# EAGLE design untitled (EAGLE 4.16)
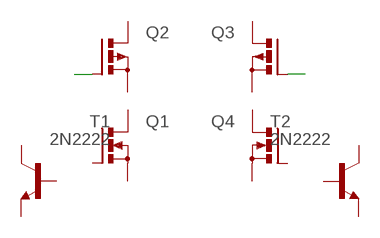
[diagram p0: schematic, sheet 1]

## Parts
Q1  PMOSFET_NTO220BV  [TO220BV]
Q2  PMOSFET_PTO220BV  [TO220BV]
Q3  PMOSFET_PTO220BV  [TO220BV]
Q4  PMOSFET_NTO220BV  [TO220BV]
T1  2N2222  [TO18]
T2  2N2222  [TO18]

## Nets
N$2: Q2.G
N$3: Q3.G
Unconnected: Q1.D Q1.G Q1.S Q2.D Q2.S Q3.D Q3.S Q4.D Q4.G Q4.S T1.1(E) T1.2(B) T1.3(C) T2.1(E) T2.2(B) T2.3(C)

## Library data of the parts
Q1 Q4 = transistor-power:PMOSFET_N: Power MOSFET N-Channel
Q2 Q3 = transistor-power:PMOSFET_P: Power MOSFET P-Channel
T1 T2 = transistor:2N2222: NPN TRANSISTOR

## Board
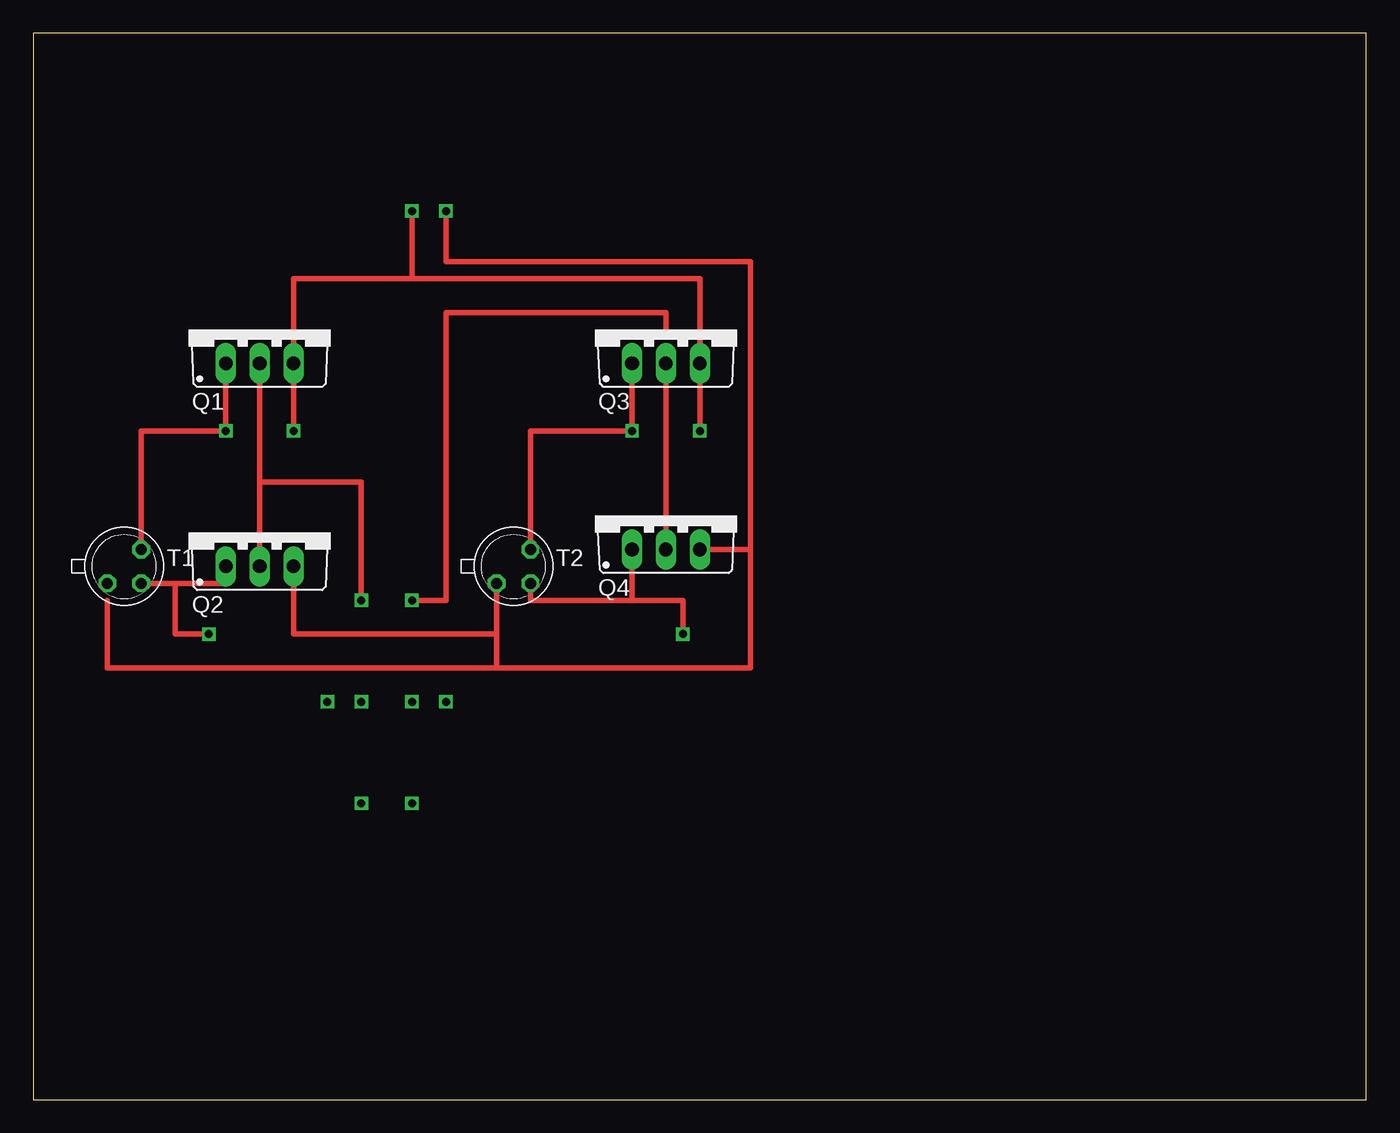
[diagram p1: board, top side]

Size 100 x 80 mm. Coordinates in mm from the lower left corner, seen from the top.
Outline: 0,0 100,0 100,80 0,80 0,0
Copper layers (1*16): Top 0.035mm / dielectric 1.5mm / Bottom 0.035mm
Design rules "default": minimum track width 10mil, minimum drill 24mil, track to track 8mil, track to pad 8mil, pad to pad 8mil, via to via 8mil, smd to smd 8mil, copper to edge 40mil, drill to drill 8mil, minimum pad ring 10mil, minimum via ring 8mil, stop-mask expansion 4mil, vias tented up to drill 0mil, thermal gap 10mil

### Footprints (pad centres in the part's own frame; a part is rotated, then mirrored left to right if it is on the bottom)
TO220BV = drill 1.016 long: D 0,-2.54; G -2.54,-2.54; S 2.54,-2.54
TO18 = drill 0.813 octagon: 1 -1.27,-1.27; 2 1.27,-1.27; 3 1.27,1.27

### Placement (x,y rotation side)
Q1  16.98,57.78 0 top
Q2  16.98,42.54 0 top
Q3  47.46,57.78 0 top
Q4  47.46,43.81 0 top
T1  6.82,40 0 top
T2  36.03,40 0 top

### Tracks (layer width: path | path; a pad name or v marks a point on that pad's centre or on a via)
N$1  (via drill 0.6)
  Top 0.406: 8.09,41.27 8.09,50.16 v14.44,50.16 14.44,55.24
N$4
  Top 0.406: 47.46,55.24 47.46,41.27
N$5
  Top 0.406: 8.09,38.73 10.63,38.73 | 10.63,38.73 14.44,38.73 14.44,40 | 10.63,38.73 10.63,34.92 13.17,34.92
N$6  (via drill 0.6)
  Top 0.406: 50,55.24 50,61.59 28.41,61.59 | 28.41,61.59 v28.41,66.67 | 19.52,55.24 19.52,61.59 28.41,61.59
N$7  (via drill 0.6)
  Top 0.406: 37.3,41.27 37.3,50.16 v44.92,50.16 44.92,53.97
N$8  (via drill 0.6)
  Top 0.406: 44.92,42.54 44.92,37.46 43.65,37.46 | 43.65,37.46 37.3,37.46 37.3,38.73 | 43.65,37.46 48.73,37.46 v48.73,34.92
N$9  (via drill 0.6)
  Top 0.406: 5.55,37.46 5.55,32.38 34.76,32.38 | v30.95,66.67 30.95,62.86 53.81,62.86 53.81,41.27 | 53.81,41.27 50,41.27 | 53.81,41.27 53.81,32.38 34.76,32.38 | 34.76,34.92 34.76,38.73 | 19.52,40 19.52,34.92 34.76,34.92 | 34.76,32.38 34.76,34.92
N$10  (via drill 0.6)
  Top 0.406: 16.98,40 16.98,46.35 | 16.98,46.35 16.98,55.24 | 16.98,46.35 24.6,46.35 v24.6,37.46
N$11  (via drill 0.6)
  Top 0.406: v50,50.16 50,55.24
N$12  (via drill 0.6)
  Top 0.406: v19.52,50.16 19.52,55.24
N$13  (via drill 0.6)
  other vias: 13.17,34.92
N$14  (via drill 0.6)
  Top 0.406: 47.46,57.78 47.46,59.05 30.95,59.05 30.95,37.46 v28.41,37.46
N$15  (via drill 0.6)
  other vias: 24.6,29.84
N$16  (via drill 0.6)
  other vias: 28.41,29.84
N$17  (via drill 0.6)
  other vias: 22.06,29.84
N$18  (via drill 0.6)
  other vias: 30.95,29.84
N$19  (via drill 0.6)
  other vias: 24.6,22.22
N$20  (via drill 0.6)
  other vias: 28.41,22.22